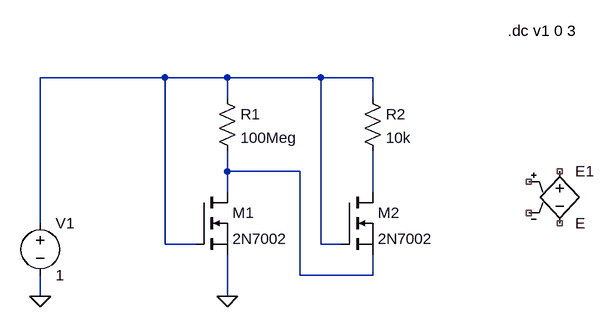
[diagram p0: schematic cmos-voltage-dependent-resistor.asc]
cmos-voltage-dependent-resistor.asc, the LTspice schematic file:
Version 4
SHEET 1 880 680
WIRE 32 -64 -160 -64
WIRE 128 -64 32 -64
WIRE 272 -64 128 -64
WIRE 352 -64 272 -64
WIRE 128 -32 128 -64
WIRE 352 -32 352 -64
WIRE 128 80 128 48
WIRE 240 80 128 80
WIRE 128 112 128 80
WIRE 352 112 352 48
WIRE -160 160 -160 -64
WIRE 32 192 32 -64
WIRE 80 192 32 192
WIRE 272 192 272 -64
WIRE 304 192 272 192
WIRE 240 240 240 80
WIRE 352 240 352 208
WIRE 352 240 240 240
WIRE -160 272 -160 240
WIRE 128 272 128 208
FLAG -160 272 0
FLAG 128 272 0
SYMBOL nmos 80 112 R0
SYMATTR InstName M1
SYMATTR Value 2N7002
SYMBOL voltage -160 144 R0
WINDOW 123 0 0 Left 0
WINDOW 39 0 0 Left 0
SYMATTR InstName V1
SYMATTR Value 1
SYMBOL res 112 -48 R0
SYMATTR InstName R1
SYMATTR Value 100Meg
SYMBOL res 336 -48 R0
SYMATTR InstName R2
SYMATTR Value 10k
SYMBOL nmos 304 112 R0
SYMATTR InstName M2
SYMATTR Value 2N7002
SYMBOL e 640 64 R0
SYMATTR InstName E1
TEXT 560 -136 Left 2 !.dc v1 0 3

The netlist it stands for:
* cmos-voltage-dependent-resistor.asc
M1 N002 N001 0 0 2N7002
V1 N001 0 1
R1 N001 N002 100Meg
R2 N001 N003 10k
M2 N003 N001 N002 N002 2N7002
E1 NC_01 NC_02 NC_03 NC_04 E
.model NMOS NMOS
.model PMOS PMOS
.lib standard.mos
.dc v1 0 3
.backanno
.end